# EAGLE design RPi_Speaker (EAGLE 6.4)
Assembly variants: 20m
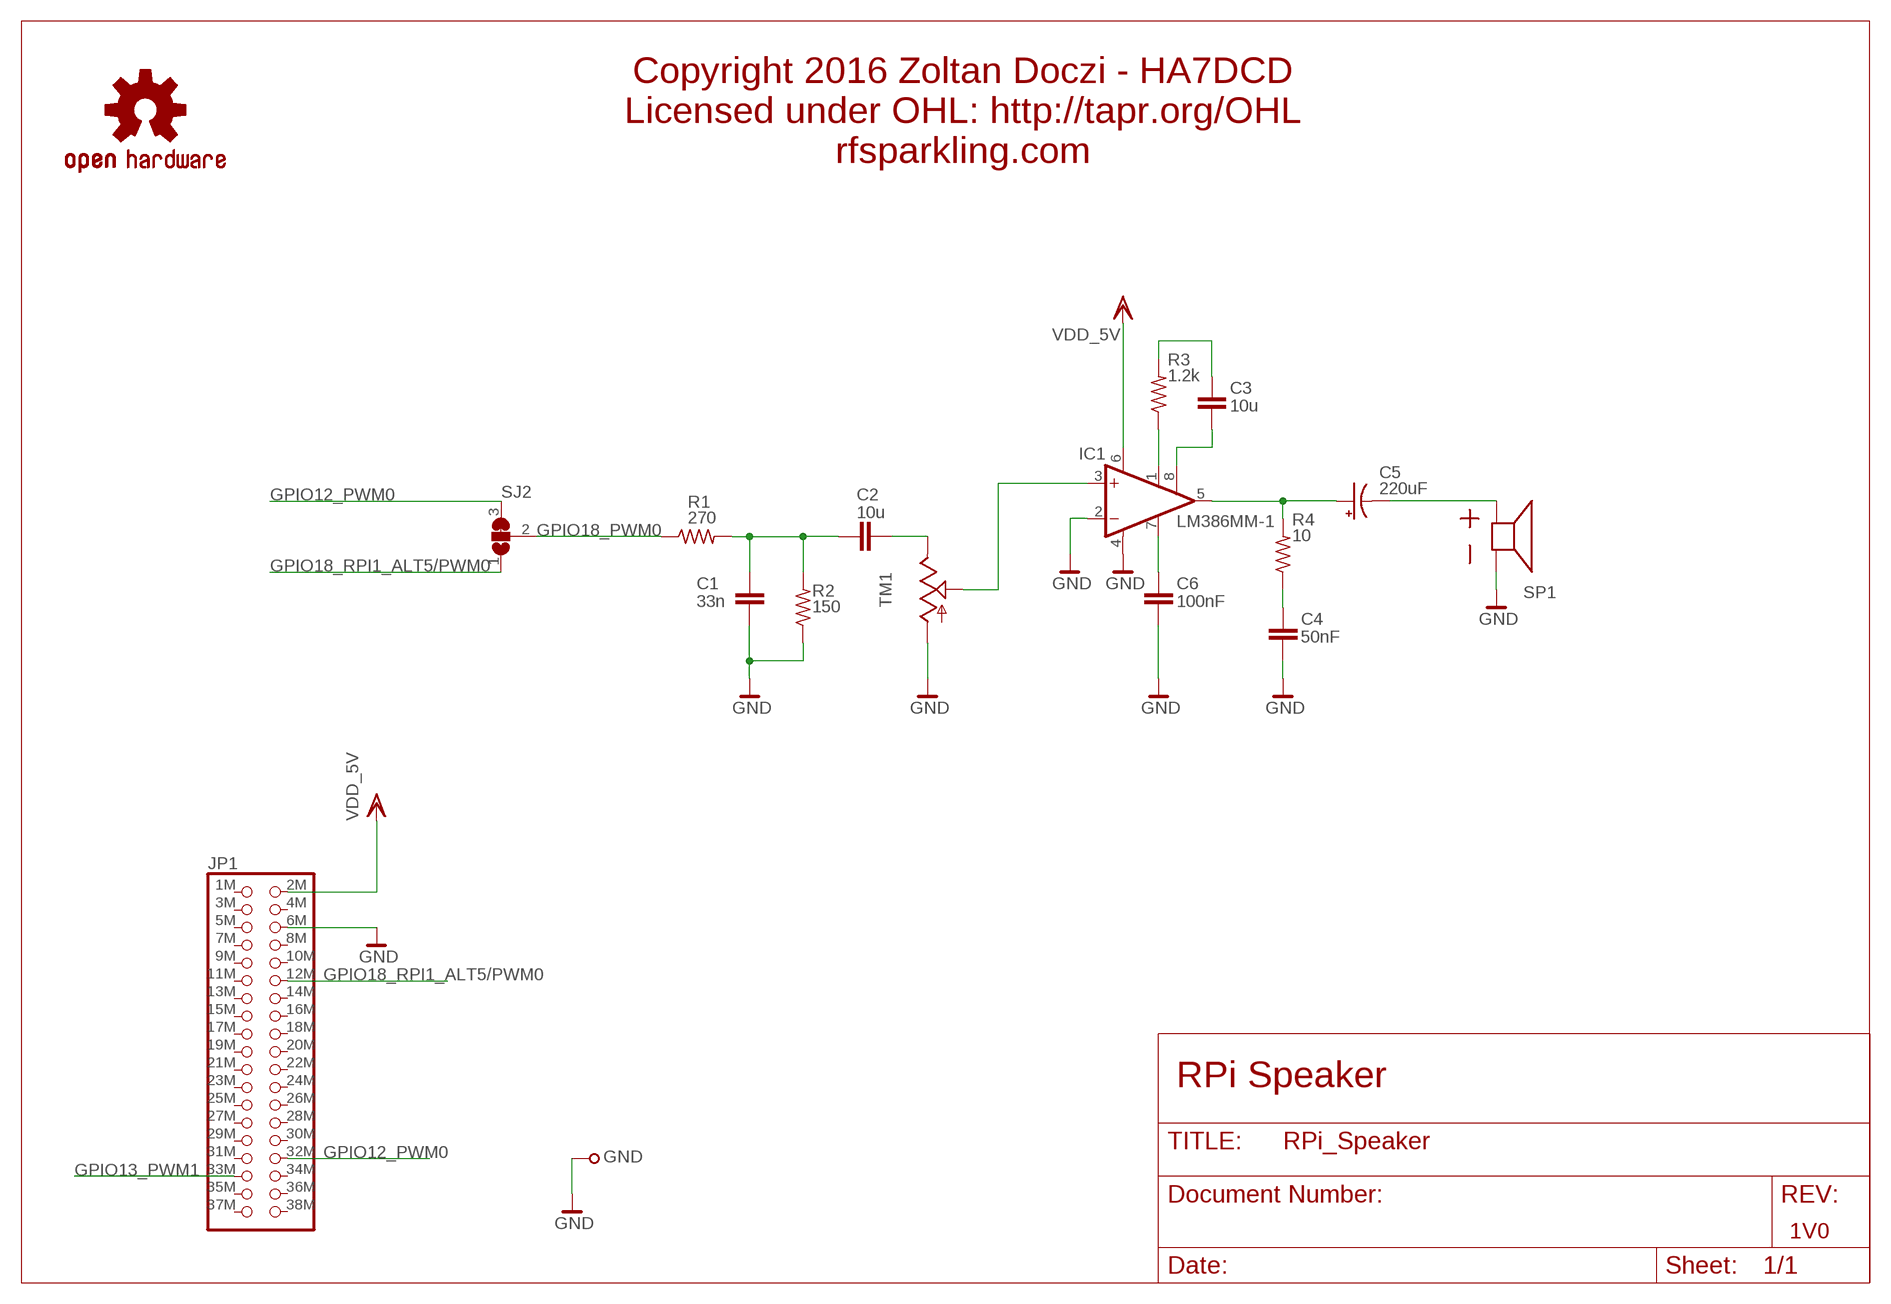
[diagram p0: schematic, sheet 1]

## Parts
C1  33n  CAP-SMD0603  [0603]
C2  10u  CAP-SMD0603  [0603]
C3  10u  CAP-SMD0603  [0603]
C4  50nF  CAP-SMD0603  [0603]
C5  220uF  CPOL-USD/7343-31R  [D/7343-31R]
C6  100nF  CAP-SMD0603  [0603]
GND  TESTPOINT39MIL  [TESTPOINT1,0]
IC1  LM386MM-1  [MMSOP08]
JP1  PINHD-2X18/MIRROR  [2X18_MIRROR]
R1  270  R-US_R0402  [R0402]
R2  150  R-US_R0402  [R0402]
R3  1.2k  R-US_R0402  [R0402]
R4  10  R-US_R0402  [R0402]
SJ2  JUMPER_SMD_3A  [JUMPER_SMD_SJ2A]
SP1  SPEAKER_ABS-210-RC  [SPEAKER_ABS-210-RC_50MM]
TM1  TRIM  [6MM]
U$15  OSHW-LOGOS  [OSHW-LOGO-S]

## Nets
GND: C1.1 C4.2 C6.2 GND.1 IC1.2(-IN) IC1.4(GND) JP1.6M R2.1 SP1.N(-) TM1.A
GPIO12_PWM0: JP1.32M SJ2.3
GPIO13_PWM1: JP1.33M
GPIO18_PWM0: R1.1 SJ2.2
GPIO18_RPI1_ALT5/PWM0: JP1.12M SJ2.1
N$1: C1.2 C2.2 R1.2 R2.2
N$2: C2.1 TM1.E
N$3: IC1.3(+IN) TM1.S
N$4: IC1.1(GAIN) R3.1
N$5: C3.1 R3.2
N$6: C3.2 IC1.8(GAIN)
N$7: C5.+ IC1.5(OUT) R4.2
N$8: C4.1 R4.1
N$9: C5.- SP1.P(+)
N$10: C6.1 IC1.7(BYPASS)
VDD_5V: IC1.6(VS) JP1.2M
Unconnected: JP1.1M JP1.3M JP1.4M JP1.5M JP1.7M JP1.8M JP1.9M JP1.10M JP1.11M JP1.13M JP1.14M JP1.15M JP1.16M JP1.17M JP1.18M JP1.19M JP1.20M JP1.21M JP1.22M JP1.23M JP1.24M JP1.25M JP1.26M JP1.27M JP1.28M JP1.29M JP1.30M JP1.31M JP1.34M JP1.35M JP1.36M JP1.37M JP1.38M

## Notes on the sheet
- Copyright 2016 Zoltan Doczi - HA7DCD
  Licensed under OHL: http://tapr.org/OHL
  rfsparkling.com
- RPi Speaker
- 1V0

## Library data of the parts
C1-C4 C6 = lve_modositott:CAP-SMD
C5 = adafruit:CPOL-US: POLARIZED CAPACITOR, American symbol; DISTRI: Farnall; DISTRINR: 2250182
GND = dzo:TESTPOINT
IC1 = linear:LM386?-*: Low Voltage Audio Power Amplifier Source: http://cache.national.com/ds/LM/LM386.pdf
JP1 = dzo:PINHD-2X18: 2 x 18 pins
R1-R4 = dzo:R-US_: RESISTOR, American symbol
SJ2 = dzo:JUMPER_SMD_3A
SP1 = dzo:SPEAKER; DISTRI: Farnell; DISTRINR: 1300022
TM1 = dzo:TRIM
U$15 = Pinoccio:OSHW-LOGO: Open Source Hardware Logo This logo indicates the piece of hardware it is found on incorporates a OSHW license and/or adheres to the definition of open source hardware found here: http://freedomdefined.org/OSHW

## Board
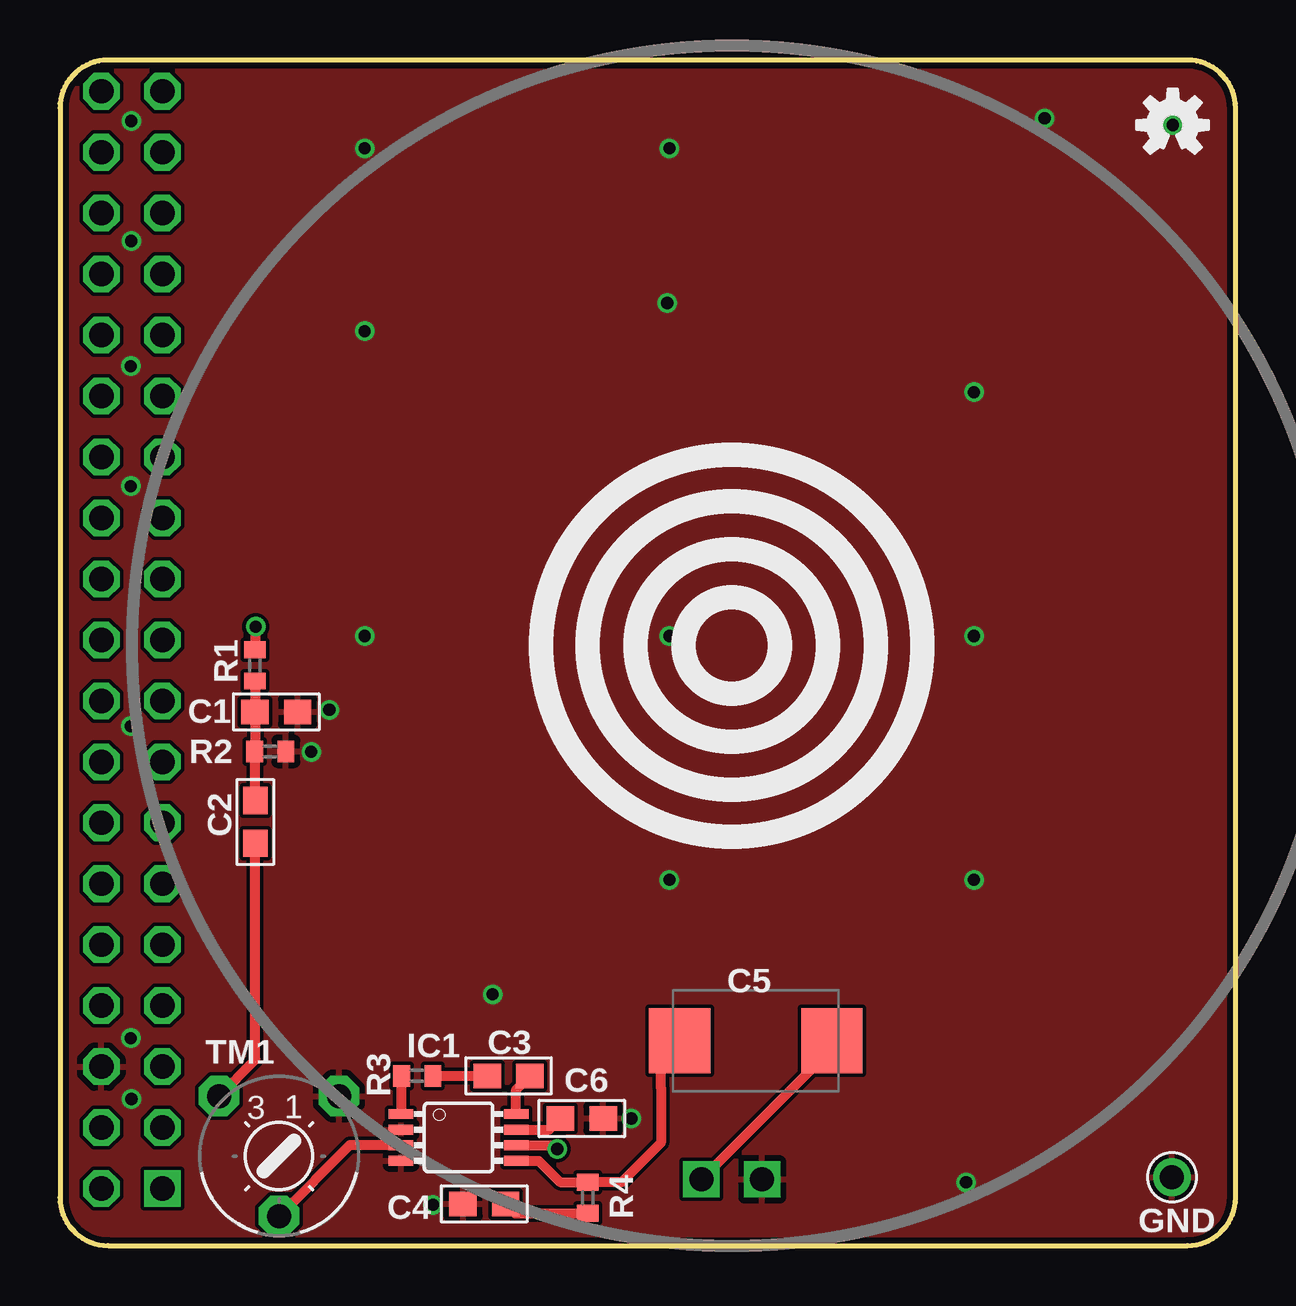
[diagram p1: board, top side]
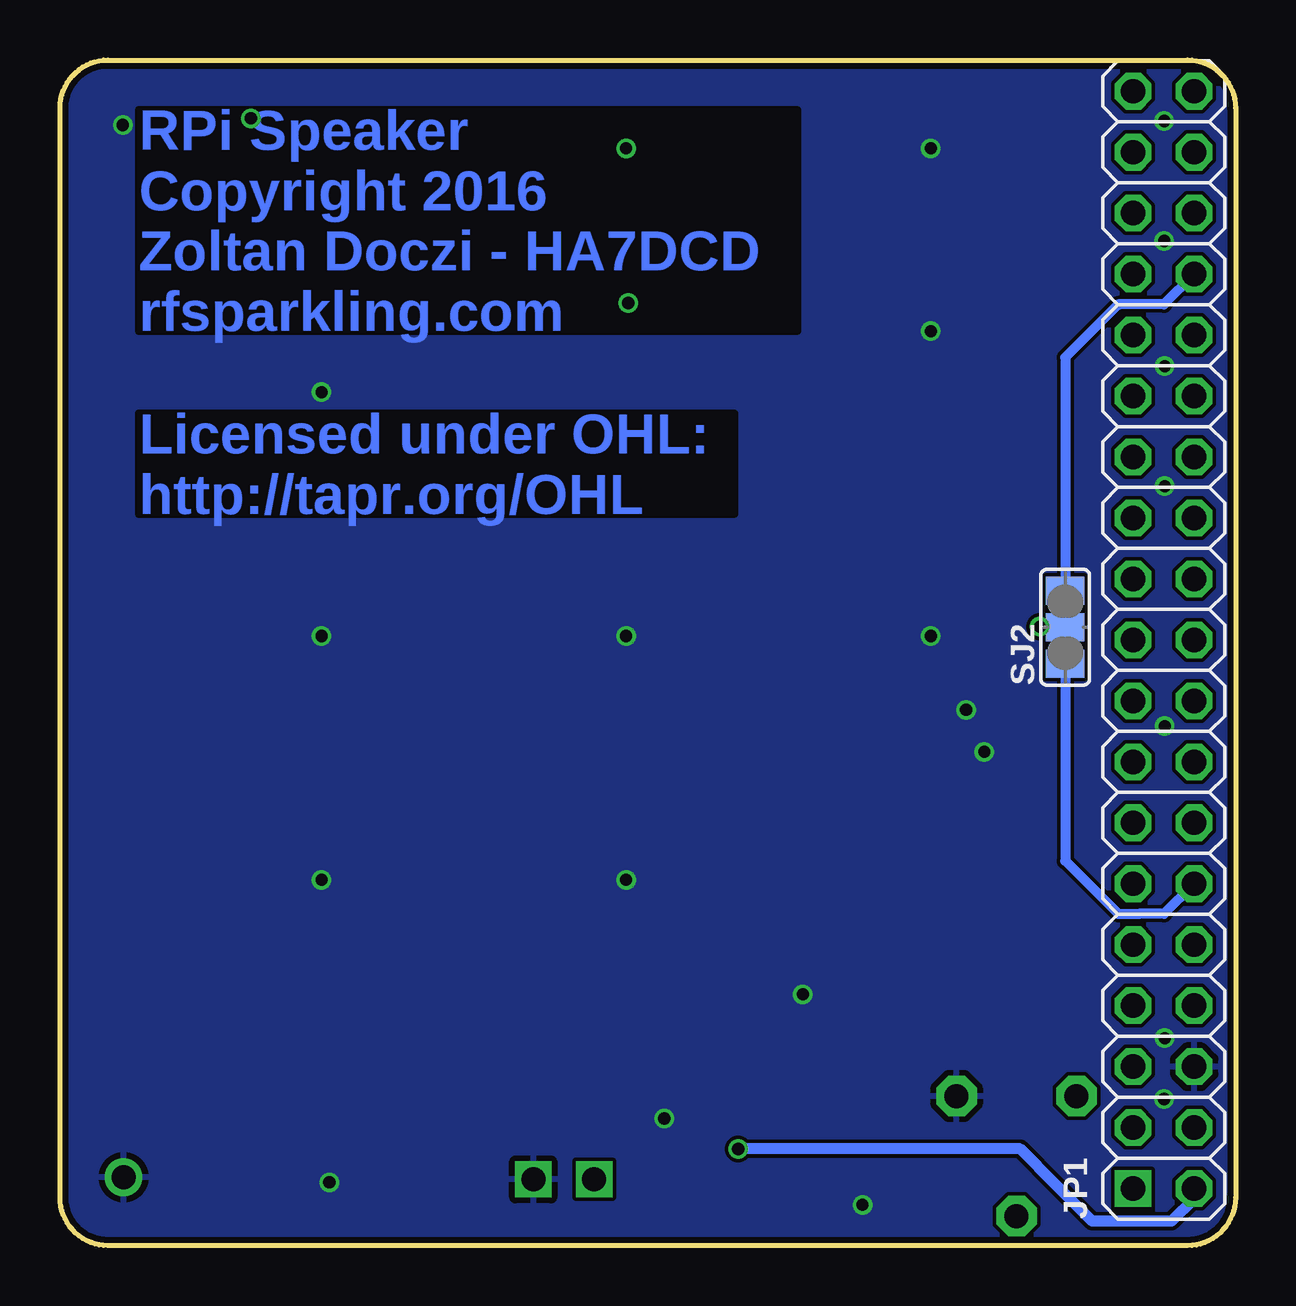
[diagram p2: board, bottom side, seen from below]

Size 49 x 49.4 mm. Coordinates in mm from the lower left corner, seen from the top.
Outline: 49,2 49,47.4 arc90 47,49.4 2,49.4 arc90 0,47.4 0,2 arc90 2,0 47,0 arc90 49,2
Copper layers (1*16): Top 0.035mm / dielectric 1.5mm / Bottom 0.035mm
Design rules "ITEADstudio_DRC *": minimum track width 6mil, minimum drill 12mil, track to track 6mil, track to pad 6mil, pad to pad 6mil, via to via 6mil, smd to smd 0mil, copper to edge 10mil, drill to drill 10mil, minimum pad ring 10mil, minimum via ring 6mil, stop-mask expansion 0mil, vias tented up to drill 100mil, thermal gap 10mil

### Footprints (pad centres in the part's own frame; a part is rotated, then mirrored left to right if it is on the bottom)
0603 = smd 1.143 x 1.016: 1 -0.889,0; 2 0.889,0
D/7343-31R = smd 2.55 x 2.7: + 3.175,0; - -3.175,0
TESTPOINT1,0 = drill 1 pad 1.575: 1 0,0
MMSOP08 = smd 0.41 x 1.02: 1 -0.975,-2.4; 2 -0.325,-2.4; 3 0.325,-2.4; 4 0.975,-2.4; 5 0.975,2.4; 6 0.325,2.4; 7 -0.325,2.4; 8 -0.975,2.4
2X18_MIRROR = drill 1.016 square: 1M -21.59,1.27 | drill 1.016 octagon: 2M -21.59,-1.27; 3M -19.05,1.27; 4M -19.05,-1.27; 5M -16.51,1.27; 6M -16.51,-1.27; 7M -13.97,1.27; 8M -13.97,-1.27; 9M -11.43,1.27; 10M -11.43,-1.27; 11M -8.89,1.27; 12M -8.89,-1.27; 13M -6.35,1.27; 14M -6.35,-1.27; 15M -3.81,1.27; 16M -3.81,-1.27; 17M -1.27,1.27; 18M -1.27,-1.27; 19M 1.27,1.27; 20M 1.27,-1.27; 21M 3.81,1.27; 22M 3.81,-1.27; 23M 6.35,1.27; 24M 6.35,-1.27; 25M 8.89,1.27; 26M 8.89,-1.27; 27M 11.43,1.27; 28M 11.43,-1.27; 29M 13.97,1.27; 30M 13.97,-1.27; 31M 16.51,1.27; 32M 16.51,-1.27; 33M 19.05,1.27; 34M 19.05,-1.27; 35M 21.59,1.27; 36M 21.59,-1.27; 37M 24.13,1.27; 38M 24.13,-1.27
R0402 = smd 0.7 x 0.9: 1 -0.65,0; 2 0.65,0
JUMPER_SMD_SJ2A = smd 1.168 x 1.6: 1 -1.524,0; 2 0,0; 3 1.524,0
SPEAKER_ABS-210-RC_50MM = drill 1 square: N 1.27,-22.24; P -1.27,-22.24
6MM = drill 1 pad 1.676 octagon: A -2.5,-2.5; E 2.5,-2.5; S 0,2.5

### Placement (x,y rotation side)
C1  9.02,22.24 180 top
C2  8.14,17.65 90 top
C3  18.7,7.07 0 top
C4  17.68,1.74 180 top
C5  29.01,8.53 180 top
C6  21.75,5.3 0 top
GND  46.35,2.84 0 top
IC1  16.61,4.51 270 top
JP1  3,23.97 90 bottom
R1  8.12,24.17 270 top
R2  8.76,20.59 180 top
R3  14.89,7.07 0 top
R4  22,1.99 90 top
SJ2  7.1,25.77 90 bottom
SP1  28,25 0 top
TM1  9.13,3.73 180 top
U$15  46.38,46.69 0 top

### Tracks (layer width: path | path; a pad name or v marks a point on that pad's centre or on a via)
GND  (via drill 0.51)
  other vias: 12.7,25.4 12.7,38.1 25.32,39.27 38.1,35.56 38.1,25.4 25.4,15.24 41.04,46.97 25.4,45.72 12.7,45.72 10.47,20.57 11.23,22.32 37.77,2.64 46.38,46.69 18.03,10.47 15.55,1.7 23.81,5.3 25.4,25.4 2.97,46.86 2.97,41.86 2.95,36.64 2.95,31.64 2.95,21.64 2.95,8.64 2.98,6.11 38.1,15.24
  pour Top (rank 2): 49,0 0,0 0,49.4 49,49.4
  pour Bottom (rank 2): 49,0 0,0 0,49.4 49,49.4
GPIO12_PWM0
  Bottom 0.406: JP1.32M 2.99,39.22 4.84,39.22 4.89,39.22 7.1,37.01 SJ2.3
GPIO18_PWM0  (via drill 0.51)
  Top 0.406: R1.1 8.16,24.82 v8.16,25.79
  Bottom 0.406: SJ2.2 7.12,25.79 v8.16,25.79
GPIO18_RPI1_ALT5/PWM0
  Bottom 0.406: SJ2.1 7.1,16.03 4.89,13.82 4.03,13.82 2.99,13.82 JP1.12M
N$1
  Top 0.406: C2.2 8.11,18.95 R2.2 8.13,20.61 C1.2 R1.2
N$2
  Top 0.406: TM1.E 8.14,7.75 C2.1
N$3
  Top 0.406: IC1.3 12.08,4.18 TM1.S
N$4
  Top 0.406: IC1.1 14.24,5.51 R3.1
N$5
  Top 0.406: R3.2 C3.1
N$6
  Top 0.406: IC1.8 19.01,6.5 C3.2
N$7
  Top 0.406: IC1.5 19.96,3.53 20.48,3.01 20.84,2.64 R4.2 23.41,2.64 25.05,4.28 25.05,6.59 25.05,7.75 C5.+
N$8
  Top 0.406: C4.1 18.97,1.34 R4.1
N$9
  Top 0.406: SP1.P 32.18,8.21 C5.-
N$10
  Top 0.406: IC1.7 20.39,4.83 C6.1
VDD_5V  (via drill 0.51)
  Top 0.406: IC1.6 20.58,4.18 v20.73,4.03
  Bottom 0.457: JP1.2M 1.73,1.96 2.67,1.02 4.95,1.02 5.97,1.02 7.49,2.54 8.98,4.03 v20.73,4.03

### Text on the board
Top: TOP
Bottom: RPi Speaker / Copyright 2016 / Zoltan Doczi - HA7DCD / rfsparkling.com | BOTTOM | Licensed under OHL: / http://tapr.org/OHL